# Altium schematic sheet Sch_Sh3.SchDoc
size A
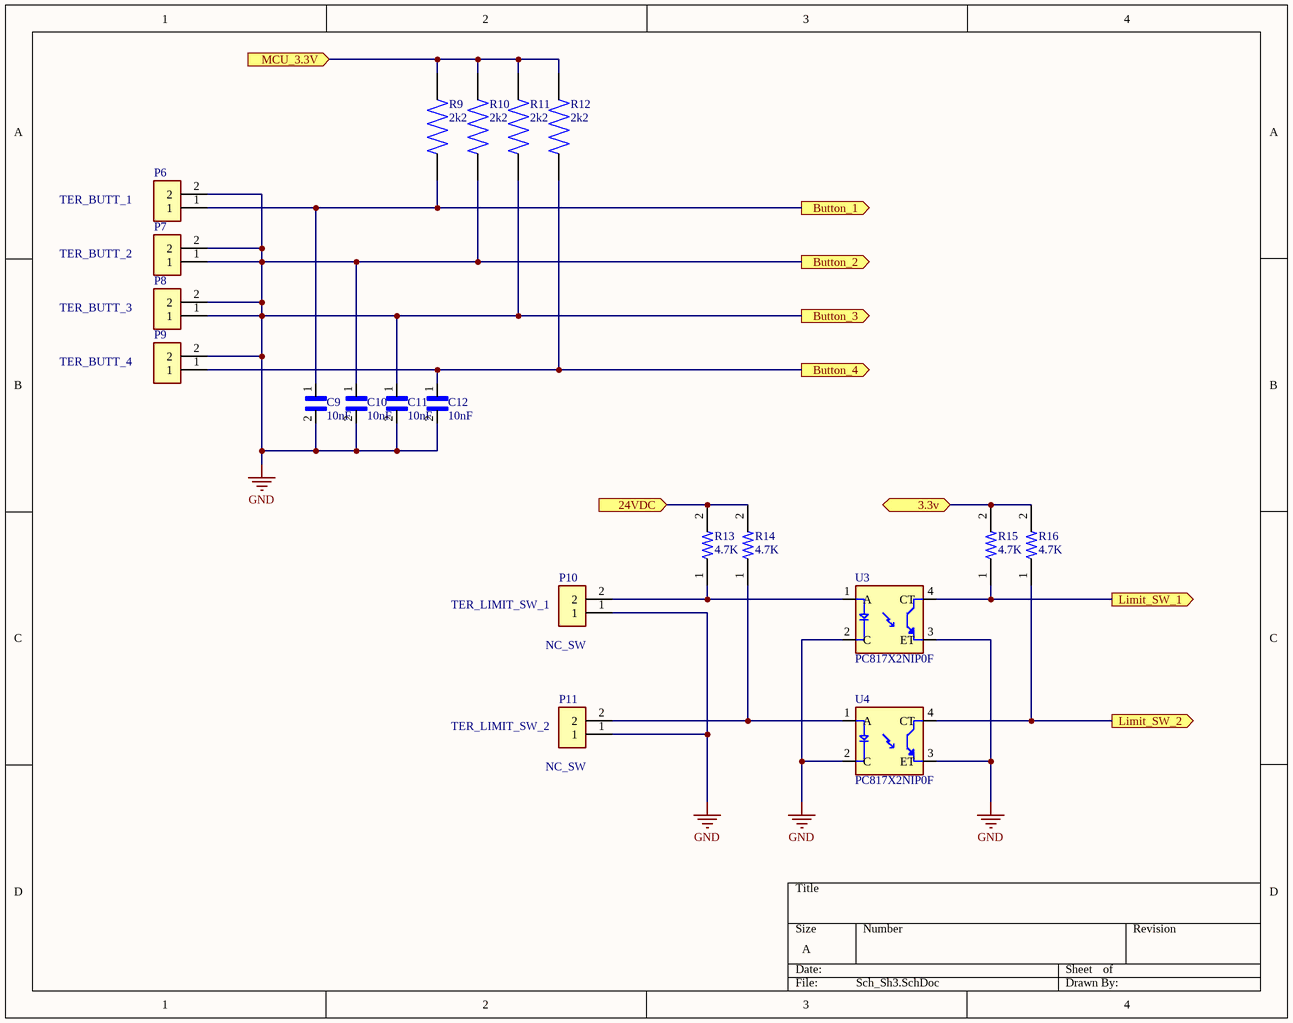
[diagram p0: Sch_Sh3.SchDoc]

## Parts
C9  10nF  [CAPC1005X55N]
C10  10nF  [CAPC1005X55N]
C11  10nF  [CAPC1005X55N]
C12  10nF  [CAPC1005X55N]
P6  Comment_1: TER_BUTT_1  [TE_282837-2]  (hidden comment: Button_1)
P7  Comment_1: TER_BUTT_2  [TE_282837-2]  (hidden comment: 282837-2)
P8  Comment_1: TER_BUTT_3  [TE_282837-2]  (hidden comment: 282837-2)
P9  Comment_1: TER_BUTT_4  [TE_282837-2]  (hidden comment: 282837-2)
P10  Comment_1: TER_LIMIT_SW_1  [TE_282837-2]  (hidden comment: 282837-2)
P11  Comment_1: TER_LIMIT_SW_2  [TE_282837-2]  (hidden comment: 282837-2)
R9  2k2  [RES_ERJ3EKF2201V]
R10  2k2  [RES_ERJ3EKF2201V]
R11  2k2  [RES_ERJ3EKF2201V]
R12  2k2  [RES_ERJ3EKF2201V]
R13  4.7K  [RESC1607X60N]
R14  4.7K  [RESC1607X60N]
R15  4.7K  [RESC1607X60N]
R16  4.7K  [RESC1607X60N]
U3  PC817X2NIP0F  [SOT254P975X400-4N]
U4  PC817X2NIP0F  [SOT254P975X400-4N]

## Ports
3.3v, 24VDC (in), Button_1 (out), Button_2 (out), Button_3 (out), Button_4 (out), Limit_SW_1 (out), Limit_SW_2 (out), MCU_3.3V (in)

## Nets
GND: C9.2 C10.1 C10.2 C11.1 C11.2 C12.2 P6.2 P7.1 P7.2 P8.1 P8.2 P9.2 P10.1 P11.1 R10.1 R11.1 U3.2(C) U3.3(ET) U4.2(C) U4.3(ET) ; port Button_2, port Button_3
3.3v: R15.2 R16.2 ; port 3.3v
24VDC: R13.2 R14.2 ; port 24VDC
Button_1: C9.1 P6.1 R9.1 ; port Button_1
Button_4: C12.1 P9.1 R12.1 ; port Button_4
Limit_SW_1: R15.1 U3.4(CT) ; port Limit_SW_1
Limit_SW_2: R16.1 U4.4(CT) ; port Limit_SW_2
MCU_3.3V: R9.2 R10.2 R11.2 R12.2 ; port MCU_3.3V
NetP10_2: P10.2 R13.1 U3.1(A)
NetP11_2: P11.2 R14.1 U4.1(A)

## Notes on the sheet
- (in symbol 282837-2) NC_SW

## Library data of the parts
C9-C12 = CC0402KRX7R9BB103: 10000 pF Â±10% 50V Ceramic Capacitor X7R 0402 (1005 Metric); MF: Yageo; Purchase-URL: https://pricing.snapeda.com/search/part/CC0402KRX7R9BB103/?ref=eda; Package: 0402 Yageo; Value: *; Check_prices: https://www.snapeda.com/parts/CC0402KRX7R9BB103/Yageo/view-part/?ref=eda; SnapEDA_Link: https://www.snapeda.com/parts/CC0402KRX7R9BB103/Yageo/view-part/?ref=snap; Availability: In Stock; Price: None; MP: CC0402KRX7R9BB103
P6-P11 = 282837-2: Connector Terminal Blocks Receptacle 2 Position 5.08mm Solder Straight Thru-Hole 13.5A/Contact; MF: TE Connectivity; Check_prices: https://www.snapeda.com/parts/282837-2/TE+Connectivity+AMP+Connectors/view-part/?ref=eda; Value: *; Availability: In Stock; MP: 282837-2; Price: None; Package: None; SnapEDA_Link: https://www.snapeda.com/parts/282837-2/TE+Connectivity+AMP+Connectors/view-part/?ref=snap; Purchase-URL: https://pricing.snapeda.com/search/part/282837-2/?ref=eda
R9-R12 = ERJ3EKF2201V: 2.2 kOhms 1% 0.1W, 1/10W Chip Resistor 0603 (1608 Metric) Automotive AEC-Q200 Thick Film; MP: ERJ-3EKF2201V; MF: Panasonic; Value: *; Package: 1608-2 Panasonic; Check_prices: https://www.snapeda.com/parts/ERJ-3EKF2201V/Panasonic%20Electronic%20Components/view-part/371927/?ref=eda; Digi-Key_Part_Number: P2.20KHCT-ND; SnapEDA_Link: https://www.snapeda.com/parts/ERJ-3EKF2201V/Panasonic%20Electronic%20Components/view-part/371927/?ref=snap
R13-R16 = RC0603FR-074K7L: 4.7 kOhms Â±1% 0.1W, 1/10W Chip Resistor 0603 _1608 Metric_ Moisture Resistant Thick Film; MF: Yageo; Value: *; SnapEDA_Link: https://www.snapeda.com/parts/RC0603FR-074K7L/Yageo/view-part/473520/?ref=snap; MP: RC0603FR-074K7L; Availability: Unavailable; Price: None; Package: 0603 Yageo
U3 U4 = PC817X2NIP0F: Optoisolator Transistor Output 5000Vrms 1 Channel 4-SMD; MF: Sharp Microelectronics; Value: *; SnapEDA_Link: https://www.snapeda.com/parts/PC817X2NIP0F/Sharp+Microelectronics/view-part/?ref=snap; Purchase-URL: https://pricing.snapeda.com/search/part/PC817X2NIP0F/?ref=eda; Check_prices: https://www.snapeda.com/parts/PC817X2NIP0F/Sharp+Microelectronics/view-part/?ref=eda; Digi-Key_Part_Number: 425-2192-2-ND; Package: SMD-4 Sharp; MP: PC817X2NIP0F